# Altium project KUR.PrjPcb
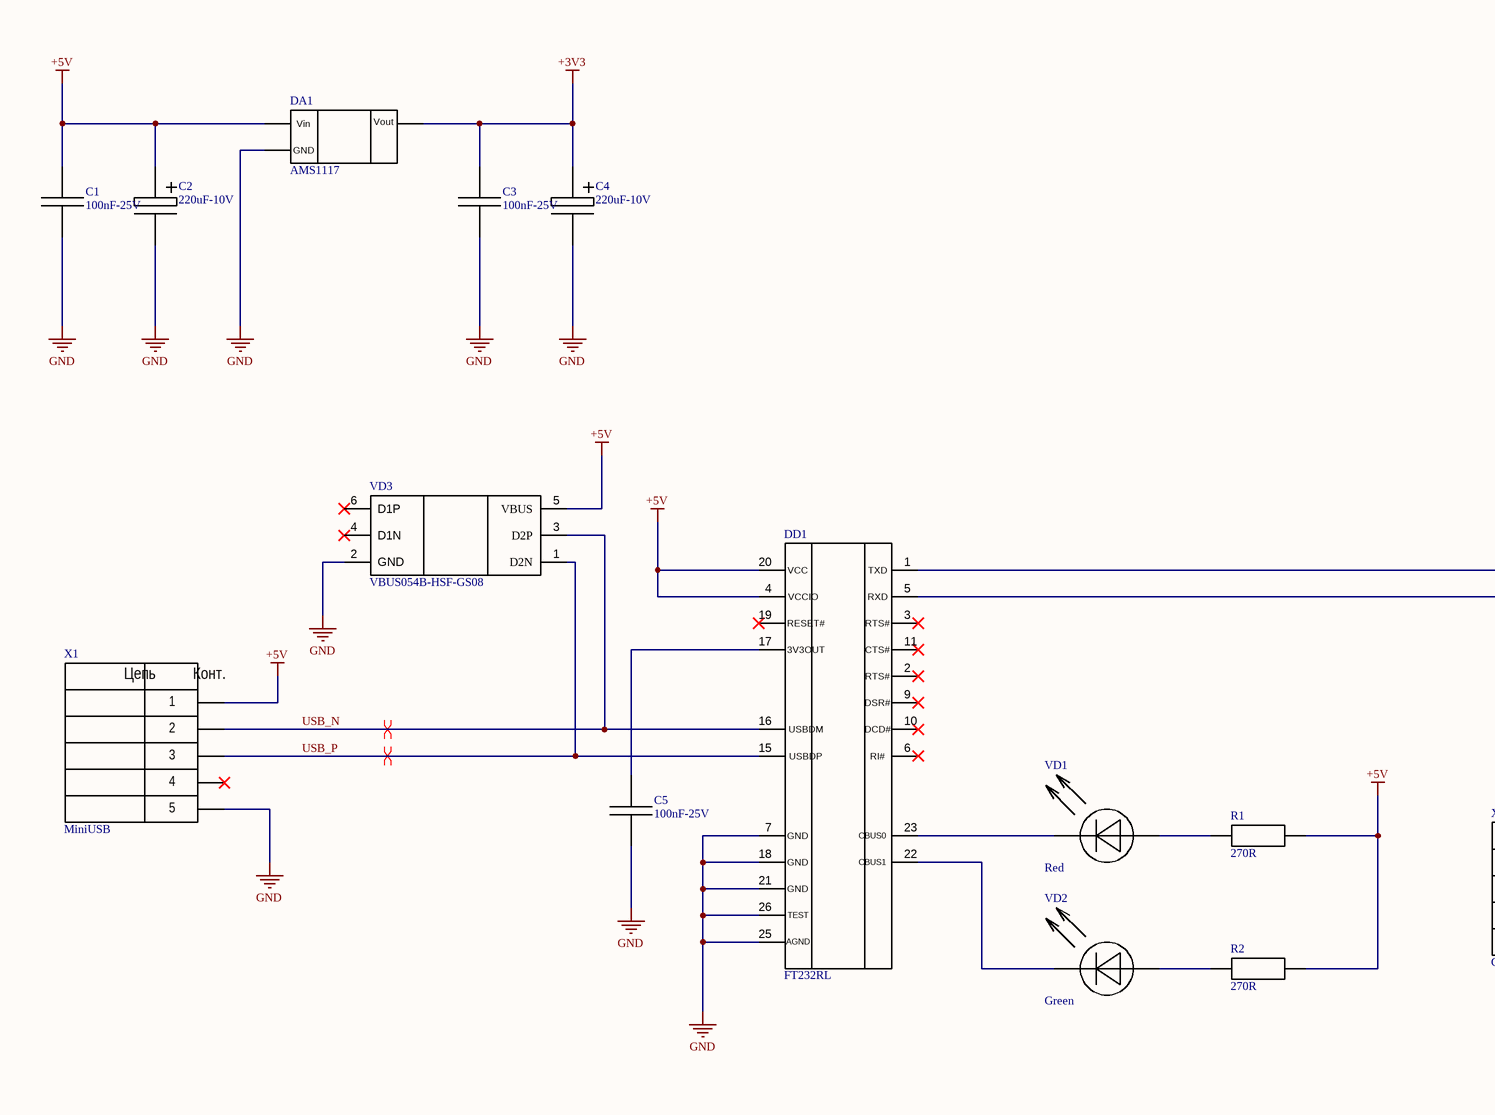
[diagram p0: Sch_Kur.SchDoc, left]
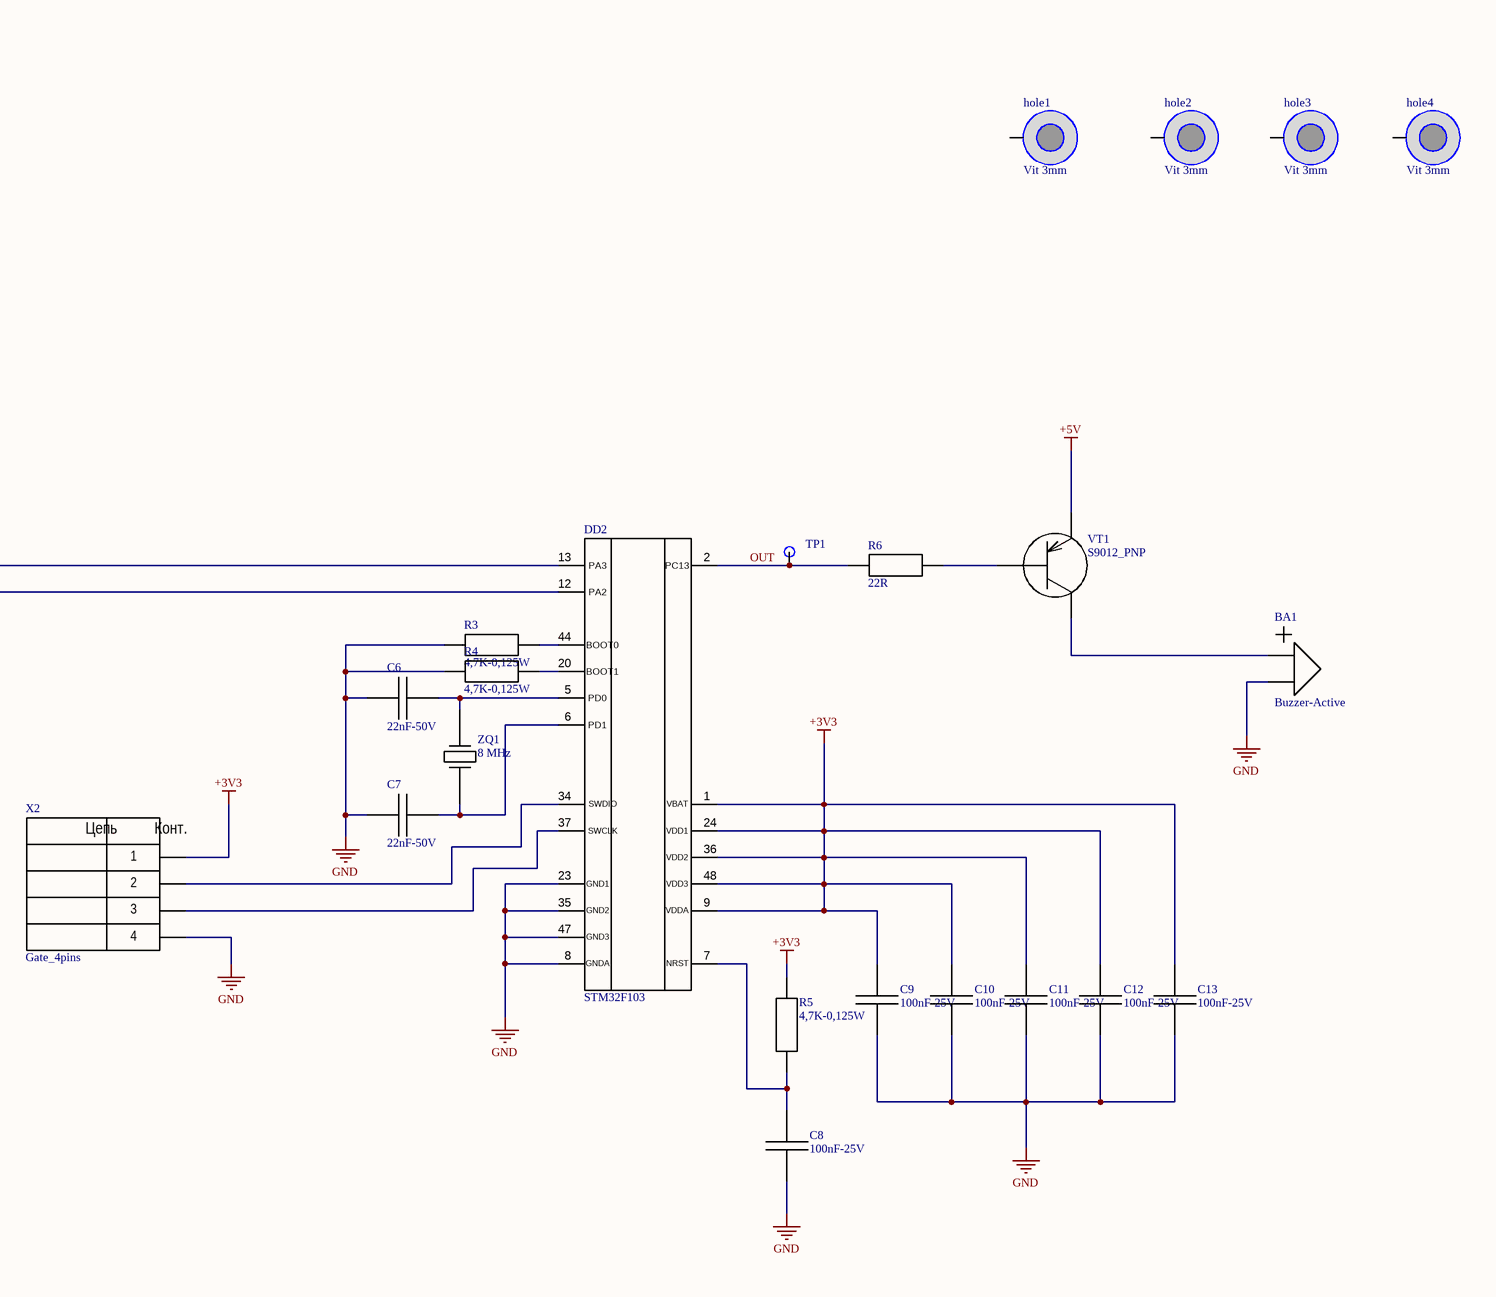
[diagram p1: Sch_Kur.SchDoc, right]
1 sheet, 35 parts. Net scope: global (net labels, ports and power ports of the same name join across sheets).
Board file: PCB_Kur.PcbDoc

## Sheet Sch_Kur.SchDoc: UART to Morse code
size 594 x 420 mm; Author: Ngô Văn Khoa; Address1: Russia; Address2: Moscow; Address3: BMSTU; Address4: IU4-61

### Parts
BA1  Buzzer-Active  [28# Buzzer MINI]
C1  100nF-25V  [Cap Ceramic 0603 SMD]
C2  220uF-10V  [CAP ALU CASE E SMD]
C3  100nF-25V  [Cap Ceramic 0603 SMD]
C4  220uF-10V  [CAP ALU CASE E SMD]
C5  100nF-25V  [Cap Ceramic 0603 SMD]
C6  22nF-50V  [Cap Ceramic 0805 SMD]
C7  22nF-50V  [Cap Ceramic 0805 SMD]
C8  100nF-25V  [Cap Ceramic 0603 SMD]
C9  100nF-25V  [Cap Ceramic 0603 SMD]
C10  100nF-25V  [Cap Ceramic 0603 SMD]
C11  100nF-25V  [Cap Ceramic 0603 SMD]
C12  100nF-25V  [Cap Ceramic 0603 SMD]
C13  100nF-25V  [Cap Ceramic 0603 SMD]
DA1  AMS1117  [AMS1117-3.3V]
DD1  FT232RL  [SSOP 28]
DD2  STM32F103  [stm32f103c8t6-48LQFP]
hole1  Vit 3mm  [Screw 3 small]
hole2  Vit 3mm  [Screw 3 small]
hole3  Vit 3mm  [Screw 3 small]
hole4  Vit 3mm  [Screw 3 small]
R1  270R  [Res 0805 SMD]
R2  270R  [Res 0805 SMD]
R3  4,7K-0,125W  [Res 0805 SMD]
R4  4,7K-0,125W  [Res 0805 SMD]
R5  4,7K-0,125W  [Res 0805 SMD]
R6  22R  [Res 0805 SMD]
TP1  TP1  [TP1]  (value not drawn)
VD1  Red  [Led 0805R]
VD2  Green  [Led 0805G]
VD3  VBUS054B-HSF-GS08  [LLP75]
VT1  S9012_PNP  [SOT-23]
X1  MiniUSB  [USB_MNI_B]
X2  Gate_4pins  [Header_4]
ZQ1  8 MHz  [CRYSTAL-HC49S]

### Nets
+3V3: C3.2 C4.1 C9.2 C10.2 C11.2 C12.2 C13.2 DA1.2 DD2.1 DD2.9 DD2.24 DD2.36 DD2.48 R5.2 X2.1
+5V: C1.2 C2.1 DA1.3 DD1.4 DD1.20 R1.2 R2.1 VD3.5(VBUS) VT1.2 X1.1
GND: BA1.2 C1.1 C2.2 C3.1 C4.2 C5.1 C6.1 C7.1 C8.1 C9.1 C10.1 C11.1 C12.1 C13.1 DA1.1 DD1.7 DD1.18 DD1.21 DD1.25 DD1.26 DD2.8 DD2.23 DD2.35 DD2.47 R3.1 R4.1 VD3.2(GND) X1.5 X2.4
OUT: DD2.2 R6.1 TP1.1
USB_N: DD1.16 VD3.3(D2P) X1.2
USB_P: DD1.15 VD3.1(D2N) X1.3
NetBA1_1: BA1.1 VT1.3
NetC5_2: C5.2 DD1.17
NetC6_2: C6.2 DD2.5 ZQ1.2
NetC7_2: C7.2 DD2.6 ZQ1.1
NetC8_2: C8.2 DD2.7 R5.1
NetDD1_1: DD1.1 DD2.13
NetDD1_5: DD1.5 DD2.12
NetDD1_22: DD1.22 VD2.2
NetDD1_23: DD1.23 VD1.2
NetDD2_20: DD2.20 R4.2
NetDD2_34: DD2.34 X2.2
NetDD2_37: DD2.37 X2.3
NetDD2_44: DD2.44 R3.2
NetR1_1: R1.1 VD1.1
NetR2_2: R2.2 VD2.1
NetR6_2: R6.2 VT1.1

Not connected (* = marked no-connect by the designer): DD1 2* 3* 6* 9* 10* 11* 19*; hole1 1(hole); hole2 1(hole); hole3 1(hole); hole4 1(hole); VD3 4(D1N)* 6(D1P)*; X1 4*

### Layout directives
differential pair: USB_N, USB_P

### Notes on the sheet
- DWG NO:
- REV:
- REVISION
- DESCRIPTION
- DATE
- APPROVED
- ENG:
- APPROVALS
- PROJECT
- DSN:
- CHK:
- REFERENCE DOCUMENTS
- PROJECT REVISION:
- TITLE
- DOCUMENT REVISION:
- DESIGN ITEM:
- BOM:
- FAB DWG:
- PCB DWG:
- ASSY DWG:
- SCALE:
- A2
- SIZE
- CAGE CODE
- FILE NAME
- AUTHOR
- SHEET
- DWG NO.
- OF
- REV
- (in symbol AMS1117-3.3) Vin; Vout; GND
- (in symbol FT232RL) VCC; TXD; VCCIO; RXD; RESET#; RTS#; 3V3OUT; CTS#; DSR#; USBDM; DCD#; USBDP; RI#; GND; CBUS0; CBUS1; TEST; AGND
- (in symbol Gate_4pins) Цепь; Конт.
- (in symbol Mini_USB) Цепь; Конт.
- (in symbol STM32F103C8T6) PA3; PC13; PA2; BOOT0; BOOT1; PD0; PD1; SWDIO; VBAT; SWCLK; VDD1; VDD2; GND1; VDD3; GND2; VDDA; GND3; GNDA; NRST

### Library data of the parts
BA1 = Buzzer
C1 C3 C5 C8-C13 = Cap_100nF
C2 C4 = ECAP_220uF
C6 C7 = Cap_22nF
DA1 = AMS1117-3.3
DD2 = STM32F103C8T6
R1 R2 = Res_270
R3-R5 = Res_4K7
R6 = Res_22R
TP1 = Test_point
VD1 = LED_red
VD2 = LED_green
VT1 = Trans_S9012_PNP
X1 = Mini_USB
ZQ1 = Quartz resonator_8MHz